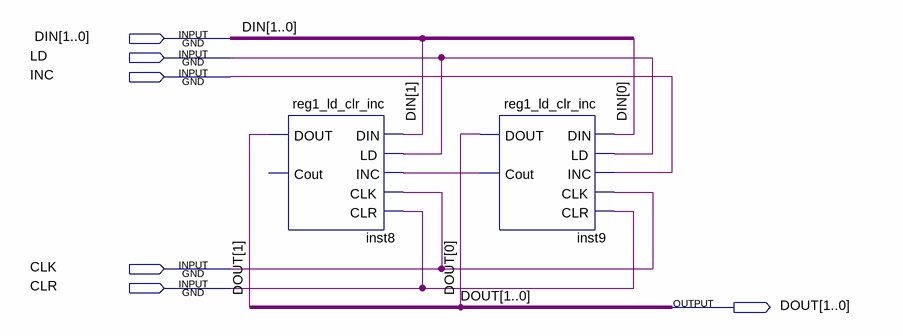
[diagram p0: schematic sheet]
// Quartus schematic reg2_ld_clr_inc.bdf as structural Verilog: 2 symbols, 6 pins
module reg2_ld_clr_inc (
  input  [1:0] DIN,
  input  LD,
  input  INC,
  input  CLK,
  input  CLR,
  output [1:0] DOUT
);

  wire inst9_cout;

  reg1_ld_clr_inc inst8 (.DIN(DIN[1]), .LD(LD), .INC(inst9_cout), .CLK(CLK), .CLR(CLR), .DOUT(DOUT[1]));  // open: Cout
  reg1_ld_clr_inc inst9 (.DIN(DIN[0]), .LD(LD), .INC(INC), .CLK(CLK), .CLR(CLR), .DOUT(DOUT[0]), .Cout(inst9_cout));
endmodule
